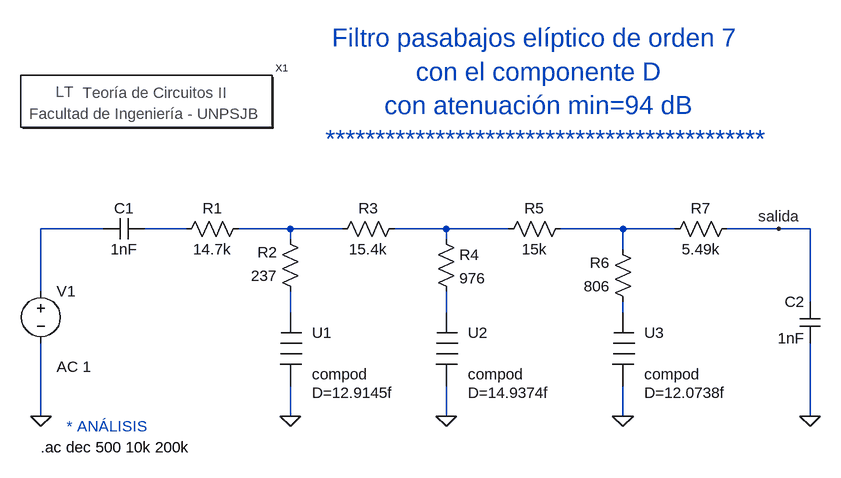
[diagram p0: schematic Filtro eliptico pasabajos de 7 orden con componente D con Amax y Amin mayores.asc]
Filtro eliptico pasabajos de 7 orden con componente D con Amax y Amin mayores.asc, the LTspice schematic file:
Version 4
SHEET 1 1296 680
WIRE -224 176 -320 176
WIRE -96 176 -160 176
WIRE 64 176 -16 176
WIRE 144 176 64 176
WIRE 304 176 224 176
WIRE 400 176 304 176
WIRE 576 176 480 176
WIRE 656 176 576 176
WIRE 816 176 736 176
WIRE 864 176 816 176
WIRE 64 192 64 176
WIRE 304 192 304 176
WIRE 576 208 576 176
WIRE -320 272 -320 176
WIRE 864 288 864 176
WIRE 64 304 64 272
WIRE 304 304 304 272
WIRE 576 304 576 288
WIRE -320 464 -320 352
WIRE 64 464 64 416
WIRE 304 464 304 416
WIRE 576 464 576 416
WIRE 864 464 864 352
FLAG 64 464 0
FLAG 304 464 0
FLAG 576 464 0
FLAG 864 464 0
FLAG -320 464 0
FLAG 816 176 salida
SYMBOL voltage -320 256 R0
WINDOW 123 24 132 Left 2
WINDOW 39 0 0 Left 2
SYMATTR Value2 AC 1
SYMATTR InstName V1
SYMATTR Value ""
SYMBOL cap -160 160 R90
WINDOW 0 0 32 VBottom 2
WINDOW 3 32 32 VTop 2
SYMATTR InstName C1
SYMATTR Value 1nF
SYMBOL cap 880 352 R180
WINDOW 0 24 64 Left 2
WINDOW 3 24 8 Left 2
SYMATTR InstName C2
SYMATTR Value 1nF
SYMBOL res 0 160 R90
WINDOW 0 0 56 VBottom 2
WINDOW 3 32 56 VTop 2
SYMATTR InstName R1
SYMATTR Value 14.7k
SYMBOL res 80 288 R180
WINDOW 0 36 76 Left 2
WINDOW 3 36 40 Left 2
SYMATTR InstName R2
SYMATTR Value 237
SYMBOL res 128 192 R270
WINDOW 0 32 56 VTop 2
WINDOW 3 0 56 VBottom 2
SYMATTR InstName R3
SYMATTR Value 15.4k
SYMBOL res 288 176 R0
SYMATTR InstName R4
SYMATTR Value 976
SYMBOL res 496 160 R90
WINDOW 0 0 56 VBottom 2
WINDOW 3 32 56 VTop 2
SYMATTR InstName R5
SYMATTR Value 15k
SYMBOL res 592 304 R180
WINDOW 0 36 76 Left 2
WINDOW 3 36 40 Left 2
SYMATTR InstName R6
SYMATTR Value 806
SYMBOL res 640 192 R270
WINDOW 0 32 56 VTop 2
WINDOW 3 0 56 VBottom 2
SYMATTR InstName R7
SYMATTR Value 5.49k
SYMBOL compod 96 304 R0
WINDOW 3 1 124 Left 2
SYMATTR Value D=12.9145f
SYMATTR InstName U1
SYMBOL compod 336 304 R0
WINDOW 3 1 124 Left 2
SYMATTR Value D=14.9374f
SYMATTR InstName U2
SYMBOL compod 608 304 R0
WINDOW 3 1 124 Left 2
SYMATTR Value D=12.0738f
SYMATTR InstName U3
SYMBOL Teoría\ de\ Circuitos\ II -160 -16 R0
SYMATTR InstName X1
TEXT 448 -40 Center 4 ;Filtro pasabajos elíptico de orden 7 \ncon el componente D\ncon atenuación min=94 dB\n********************************************
TEXT -320 512 Left 2 !.ac dec 500 10k 200k
TEXT -280 480 Left 2 ;* ANÁLISIS

The netlist it stands for:
* Filtro eliptico pasabajos de 7 orden con componente D con Amax y Amin mayores.asc
V1 N001 0 AC 1
C1 N002 N001 1nF
C2 0 salida 1nF
R1 N003 N002 14.7k
R2 N006 N003 237
R3 N003 N004 15.4k
R4 N004 N007 976
R5 N005 N004 15k
R6 N008 N005 806
R7 N005 salida 5.49k
XU1 N006 0 compod D=12.9145f  ; pins 1 2
XU2 N007 0 compod D=14.9374f  ; pins 1 2
XU3 N008 0 compod D=12.0738f  ; pins 1 2
XX1 Teoría de Circuitos II
* Filtro pasabajos elíptico de orden 7
* con el componente D
* con atenuación min=94 dB
* ********************************************
.ac dec 500 10k 200k
* * ANÁLISIS
.lib ..\sym\Circuitos2\ComponentesIdeales\compoideales.lib
.backanno
.end